# EAGLE design board (EAGLE 9.6.0)
CNAME: JTAG adapter; CREVISION: V1
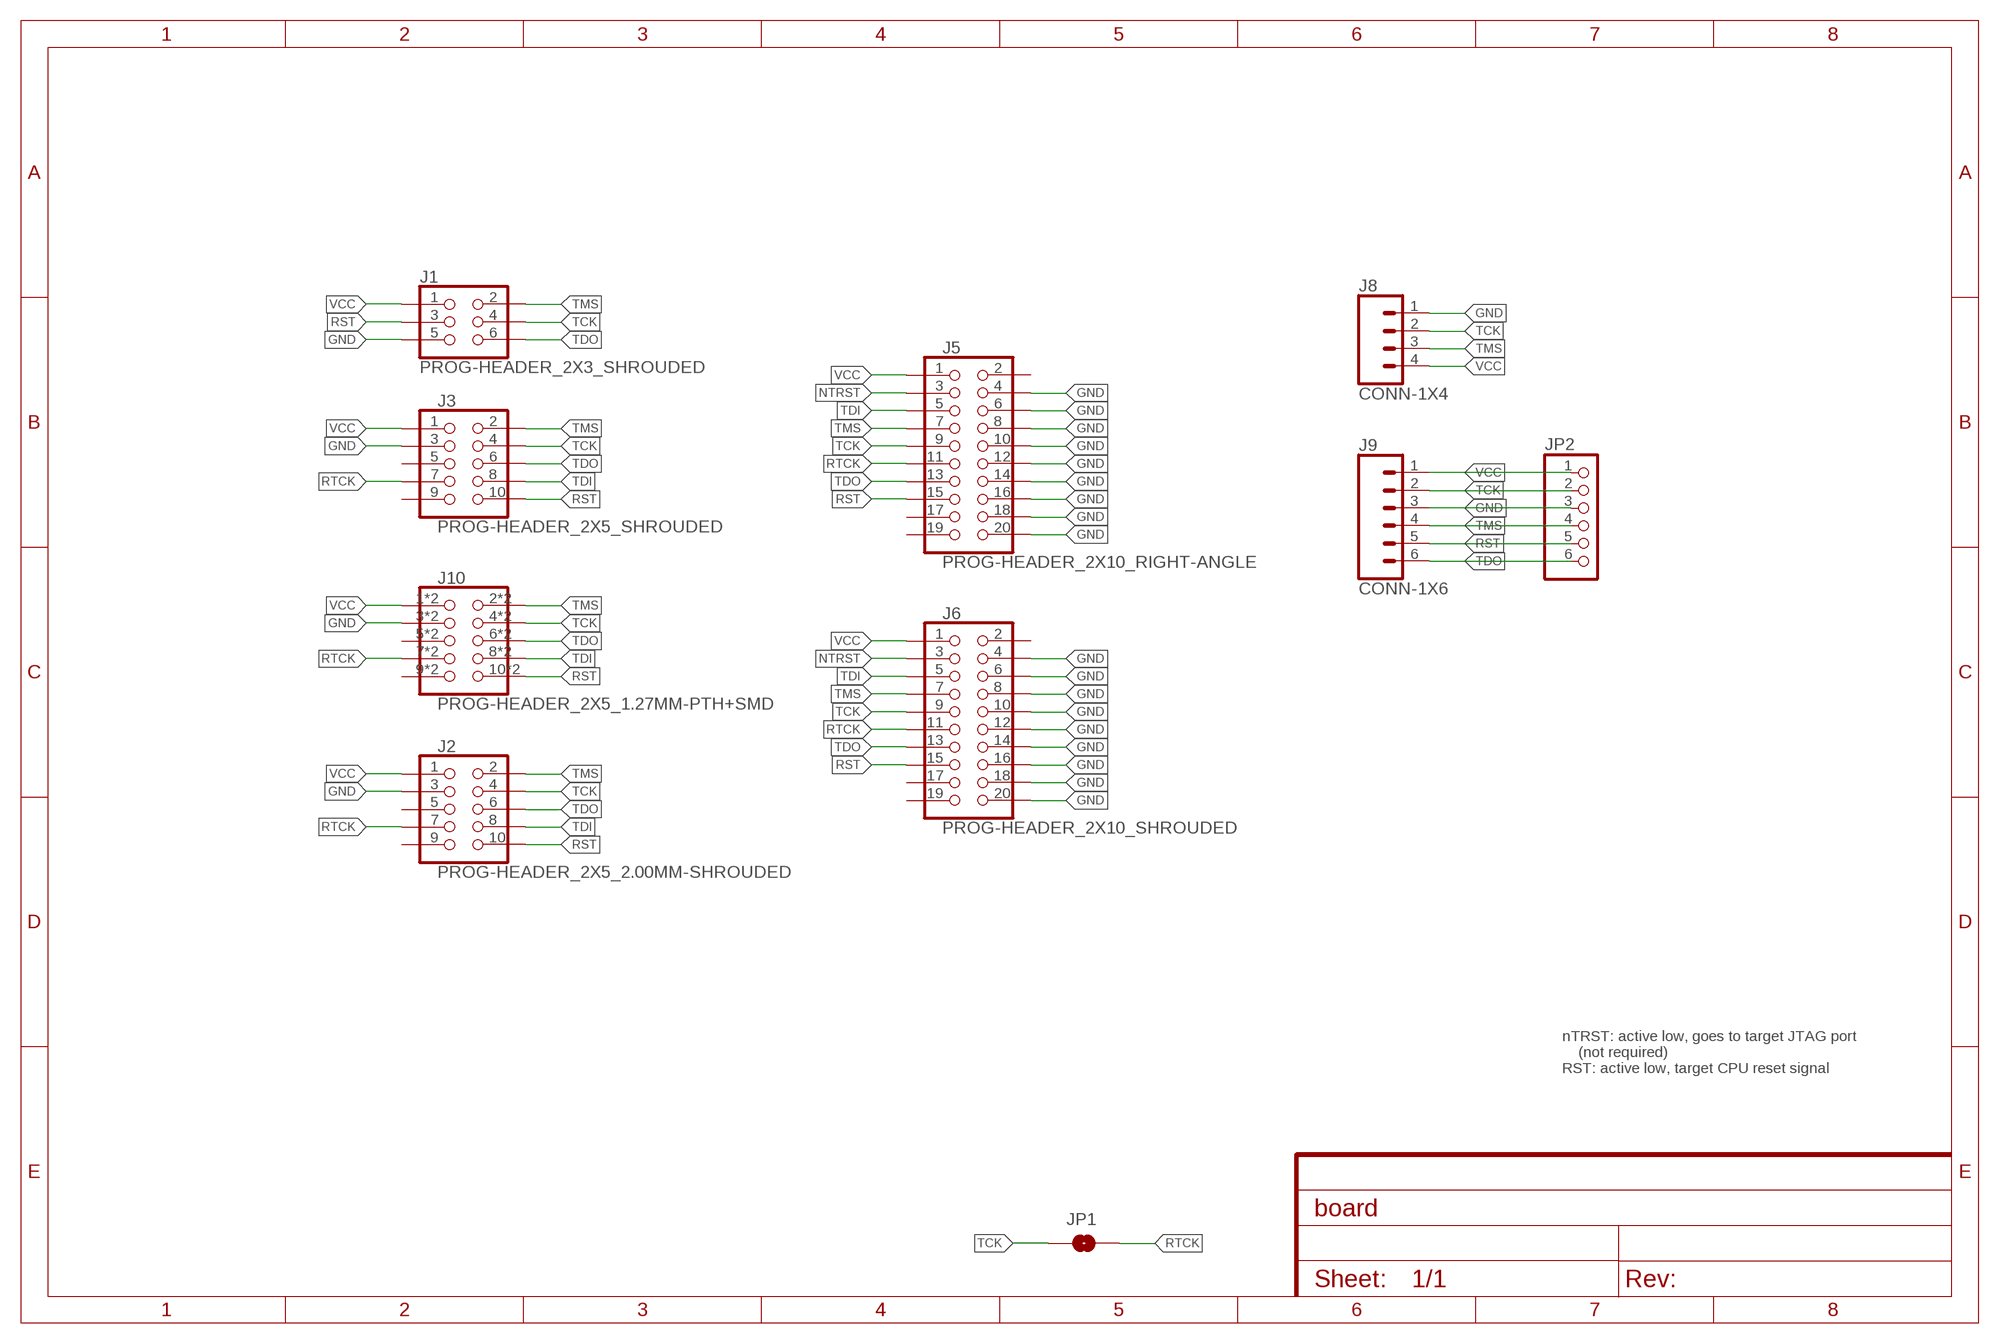
[diagram p0: schematic, sheet 1]

## Parts
J1  PROG-HEADER_2X3_SHROUDED  [2X3-2.54MM-SHROUDED]
J2  PROG-HEADER_2X5_2.00MM-SHROUDED  [2X5-2.00MM-SHROUDED]
J3  PROG-HEADER_2X5_SHROUDED  [2X5-2.54MM-SHROUDED]
J5  PROG-HEADER_2X10_RIGHT-ANGLE  [2X10-2.54MM-RIGHT-ANGLE]
J6  PROG-HEADER_2X10_SHROUDED  [2X10-2.54MM-SHROUDED]
J8  CONN-1X4  [MOLEX-1X4-2.54MM]
J9  CONN-1X6  [MOLEX-1X6-2.54MM]
J10  PROG-HEADER_2X5_1.27MM-PTH+SMD  [2X5-1.27MM_PTH+SMD]
JP1  TCK-RTCK  JUMPER-SMT_2_NO_SILK  [SMT-JUMPER_2_NO_SILK]
JP2  PINHD-1X6/OCT  [1X06/OCT]

## Nets
GND: J1.5 J2.3 J3.3 J5.4 J5.6 J5.8 J5.10 J5.12 J5.14 J5.16 J5.18 J5.20 J6.4 J6.6 J6.8 J6.10 J6.12 J6.14 J6.16 J6.18 J6.20 J8.1 J9.3 J10.3 J10.13 JP2.3
NTRST: J5.3 J6.3
RST: J1.3 J2.10 J3.10 J5.15 J6.15 J9.5 J10.10 J10.20 JP2.5
RTCK: J2.7 J3.7 J5.11 J6.11 J10.7 J10.17 JP1.2
TCK: J1.4 J2.4 J3.4 J5.9 J6.9 J8.2 J9.2 J10.4 J10.14 JP1.1 JP2.2
TDI: J2.8 J3.8 J5.5 J6.5 J10.8 J10.18
TDO: J1.6 J2.6 J3.6 J5.13 J6.13 J9.6 J10.6 J10.16 JP2.6
TMS: J1.2 J2.2 J3.2 J5.7 J6.7 J8.3 J9.4 J10.2 J10.12 JP2.4
VCC: J1.1 J2.1 J3.1 J5.1 J6.1 J8.4 J9.1 J10.1 J10.11 JP2.1
Unconnected: J2.5 J2.9 J3.5 J3.9 J5.17 J5.19 J6.17 J6.19 J10.5 J10.9 J10.15 J10.19

## Notes on the sheet
- nTRST: active low, goes to target JTAG port
      (not required)
  RST: active low, target CPU reset signal

## Power pins joined to a net without a drawn wire
2: J5.2 J6.2

## Library data of the parts
J1 = angrypig7-Connectors-Programming:PROG-HEADER_2X3
J2 J10 = angrypig7-Connectors-Programming:PROG-HEADER_2X5
J3 = angrypig7-Connectors-Programming:PROG-HEADER_2X5; PROD_ID: CONN-08671; SF_ID: PRT-08506
J5 J6 = angrypig7-Connectors-Programming:PROG-HEADER_2X10
J8 = angrypig7-Connectors-Programming:CONN-1X4
J9 = angrypig7-Connectors-Programming:CONN-1X6
JP1 = SparkFun-Jumpers:JUMPER-SMT_2_NO: Normally open jumper This jumper has two pads in close proximity to each other. Apply solder to close the connection. Round pads are easier to solder for beginners, but are a lot larger. SparkFun Product that uses the round pads: SparkFun EL Sequencer <https://www.sparkfun.com/products/12781>
JP2 = pinhead_v2:PINHD-1X6: PIN HEADER

## Net classes
0 default: width 0.254 mm

## Board
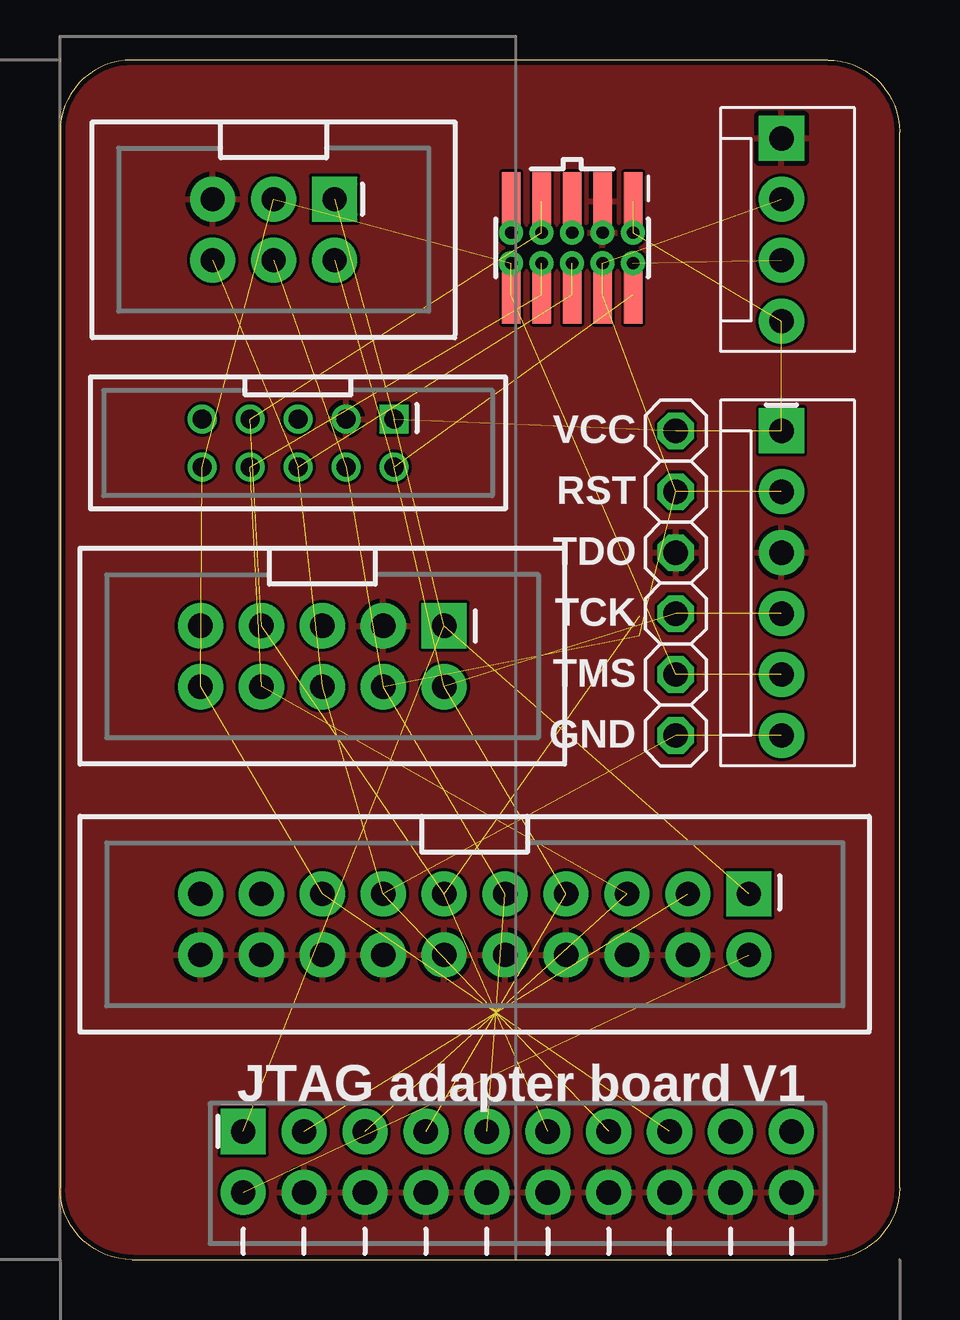
[diagram p1: board, top side]
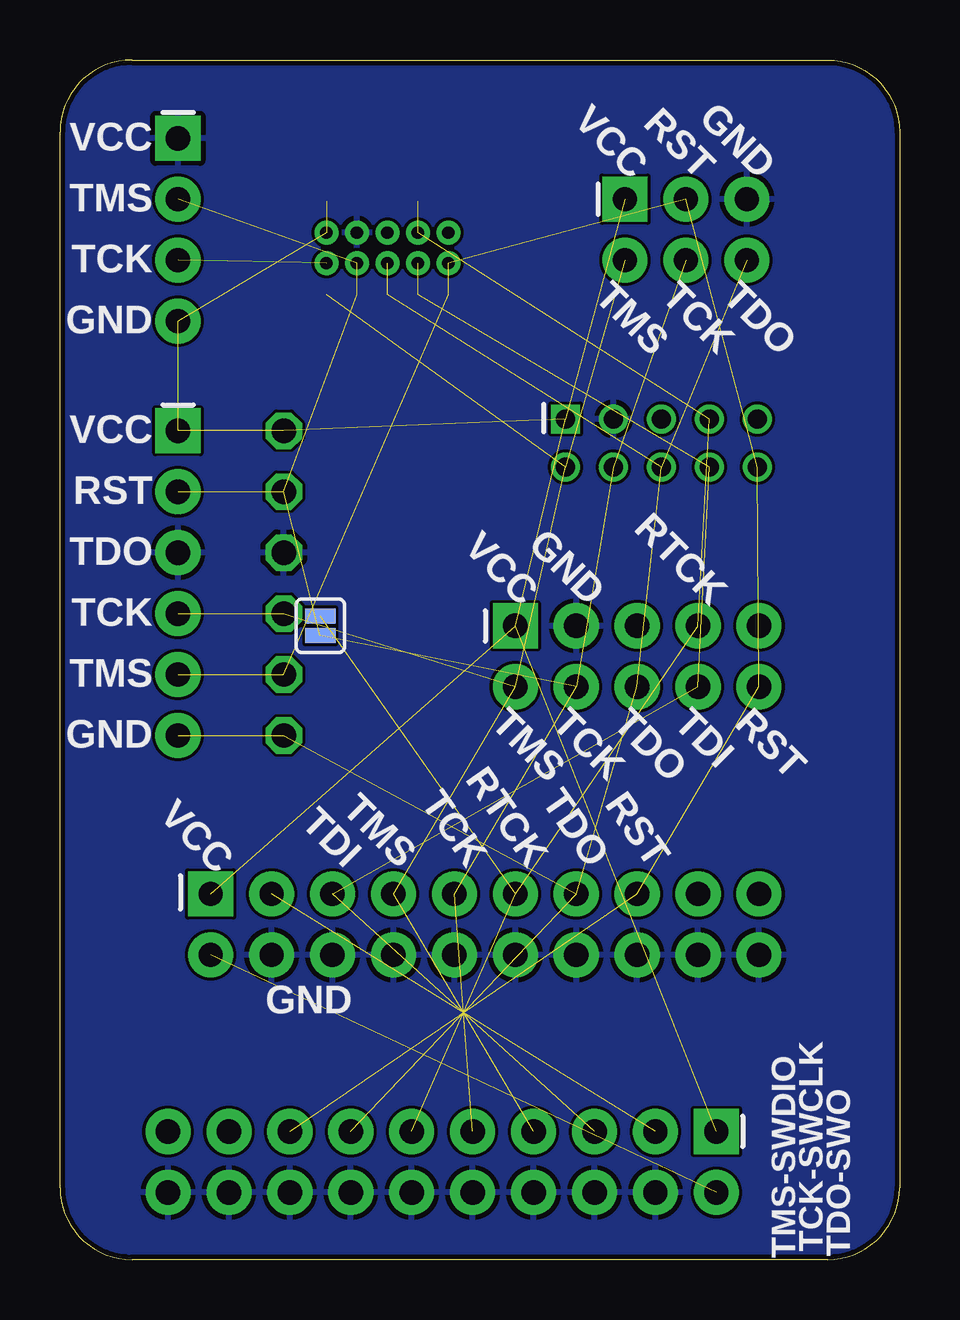
[diagram p2: board, bottom side, seen from below]

Size 35 x 50 mm. Coordinates in mm from the lower left corner, seen from the top.
Outline: 3,0 32,0 arc90 35,3 35,47 arc90 32,50 3,50 arc90 0,47 0,3 arc90 3,0
Copper layers (1*16): Top 0.035mm / dielectric 1.5mm / Bottom 0.035mm
Design rules "JLCPCB_2-Layer": minimum track width 5mil, minimum drill 0.2mm, track to track 5mil, track to pad 5mil, pad to pad 5mil, via to via 5mil, smd to smd 5mil, copper to edge 8mil, drill to drill 3mil, minimum pad ring 3mil, minimum via ring 0.2mm, stop-mask expansion 4mil, vias tented up to drill 15mil, thermal gap 8mil

### Footprints (pad centres in the part's own frame; a part is rotated, then mirrored left to right if it is on the bottom)
2X3-2.54MM-SHROUDED = drill 1.016 pad 1.88 square: 1 -1.27,2.54 | drill 1.016 pad 1.88: 2 1.27,2.54; 3 -1.27,0; 4 1.27,0; 5 -1.27,-2.54; 6 1.27,-2.54
2X5-2.00MM-SHROUDED = drill 0.8 square: 1 -1,4 | drill 0.8: 2 1,4; 3 -1,2; 4 1,2; 5 -1,0; 6 1,0; 7 -1,-2; 8 1,-2; 9 -1,-4; 10 1,-4
2X5-2.54MM-SHROUDED = drill 1.016 pad 1.88 square: 1 -1.27,5.08 | drill 1.016 pad 1.88: 2 1.27,5.08; 3 -1.27,2.54; 4 1.27,2.54; 5 -1.27,0; 6 1.27,0; 7 -1.27,-2.54; 8 1.27,-2.54; 9 -1.27,-5.08; 10 1.27,-5.08
2X10-2.54MM-RIGHT-ANGLE = drill 1.016 pad 1.88 square: 1 1.27,11.43 | drill 1.016 pad 1.88: 2 -1.27,11.43; 3 1.27,8.89; 4 -1.27,8.89; 5 1.27,6.35; 6 -1.27,6.35; 7 1.27,3.81; 8 -1.27,3.81; 9 1.27,1.27; 10 -1.27,1.27; 11 1.27,-1.27; 12 -1.27,-1.27; 13 1.27,-3.81; 14 -1.27,-3.81; 15 1.27,-6.35; 16 -1.27,-6.35; 17 1.27,-8.89; 18 -1.27,-8.89; 19 1.27,-11.43; 20 -1.27,-11.43
2X10-2.54MM-SHROUDED = drill 1.016 pad 1.88 square: 1 -1.27,11.43 | drill 1.016 pad 1.88: 2 1.27,11.43; 3 -1.27,8.89; 4 1.27,8.89; 5 -1.27,6.35; 6 1.27,6.35; 7 -1.27,3.81; 8 1.27,3.81; 9 -1.27,1.27; 10 1.27,1.27; 11 -1.27,-1.27; 12 1.27,-1.27; 13 -1.27,-3.81; 14 1.27,-3.81; 15 -1.27,-6.35; 16 1.27,-6.35; 17 -1.27,-8.89; 18 1.27,-8.89; 19 -1.27,-11.43; 20 1.27,-11.43
MOLEX-1X4-2.54MM = drill 1.016 pad 1.88 square: 1 0,0 | drill 1.016 pad 1.88: 2 2.54,0; 3 5.08,0; 4 7.62,0
MOLEX-1X6-2.54MM = drill 1.016 pad 1.88 square: 1 0,0 | drill 1.016 pad 1.88: 2 2.54,0; 3 5.08,0; 4 7.62,0; 5 10.16,0; 6 12.7,0
2X5-1.27MM_PTH+SMD = smd 0.76 x 2.4: 1 -2.54,-1.95; 2 -2.54,1.95; 3 -1.27,-1.95; 4 -1.27,1.95; 5 0,-1.95; 6 0,1.95; 7 1.27,-1.95; 8 1.27,1.95; 9 2.54,-1.95; 10 2.54,1.95 | drill 0.508 pad 1: 11 -2.54,-0.635; 12 -2.54,0.635; 13 -1.27,-0.635; 14 -1.27,0.635; 15 0,-0.635; 16 0,0.635; 17 1.27,-0.635; 18 1.27,0.635; 19 2.54,-0.635; 20 2.54,0.635
SMT-JUMPER_2_NO_SILK = smd 0.635 x 1.27: 1 -0.406,0; 2 0.406,0
1X06/OCT = drill 1.016 octagon: 1 -6.35,0; 2 -3.81,0; 3 -1.27,0; 4 1.27,0; 5 3.81,0; 6 6.35,0

### Placement (x,y rotation side)
J1  8.91,42.93 270 top
J2  9.92,34.04 270 top
J3  10.94,25.15 270 top
J5  19.07,4.06 90 top
J6  17.29,13.97 270 top
J8  30.08,46.74 270 top
J9  30.08,34.54 270 top
J10  21.35,42.16 180 top
JP1  24.15,26.42 90 bottom
JP2  25.67,28.19 270 top

### Tracks (layer width: path | path; a pad name or v marks a point on that pad's centre or on a via)
2  (1 unrouted)
GND
  pour Top: 0,50 0,0 35,0 35,50
  pour Bottom: 0,50 0,0 35,0 35,50
NTRST  (1 unrouted)
RST  (8 unrouted)
RTCK  (6 unrouted)
TCK  (10 unrouted)
TDI  (5 unrouted)
TDO  (8 unrouted)
TMS  (8 unrouted)
VCC  (9 unrouted)

### Text on the board
tPlace: VCC | RST | TDO | TCK | TMS | GND
bPlace: VCC | GND | RST | VCC | TMS | TDO | TCK | TMS | TCK | GND | VCC | RST | TDO | RTCK | GND | VCC | TCK | TMS | RST | TDI | TDO | TCK | TMS | GND | RST | TDO | RTCK | TCK | TMS | TDI | VCC | GND | TDO-SWO | TCK-SWCLK | TMS-SWDIO